# Altium schematic sheet Sheet1.SchDoc
size A4; SheetNumber: 1; SheetTotal: 1
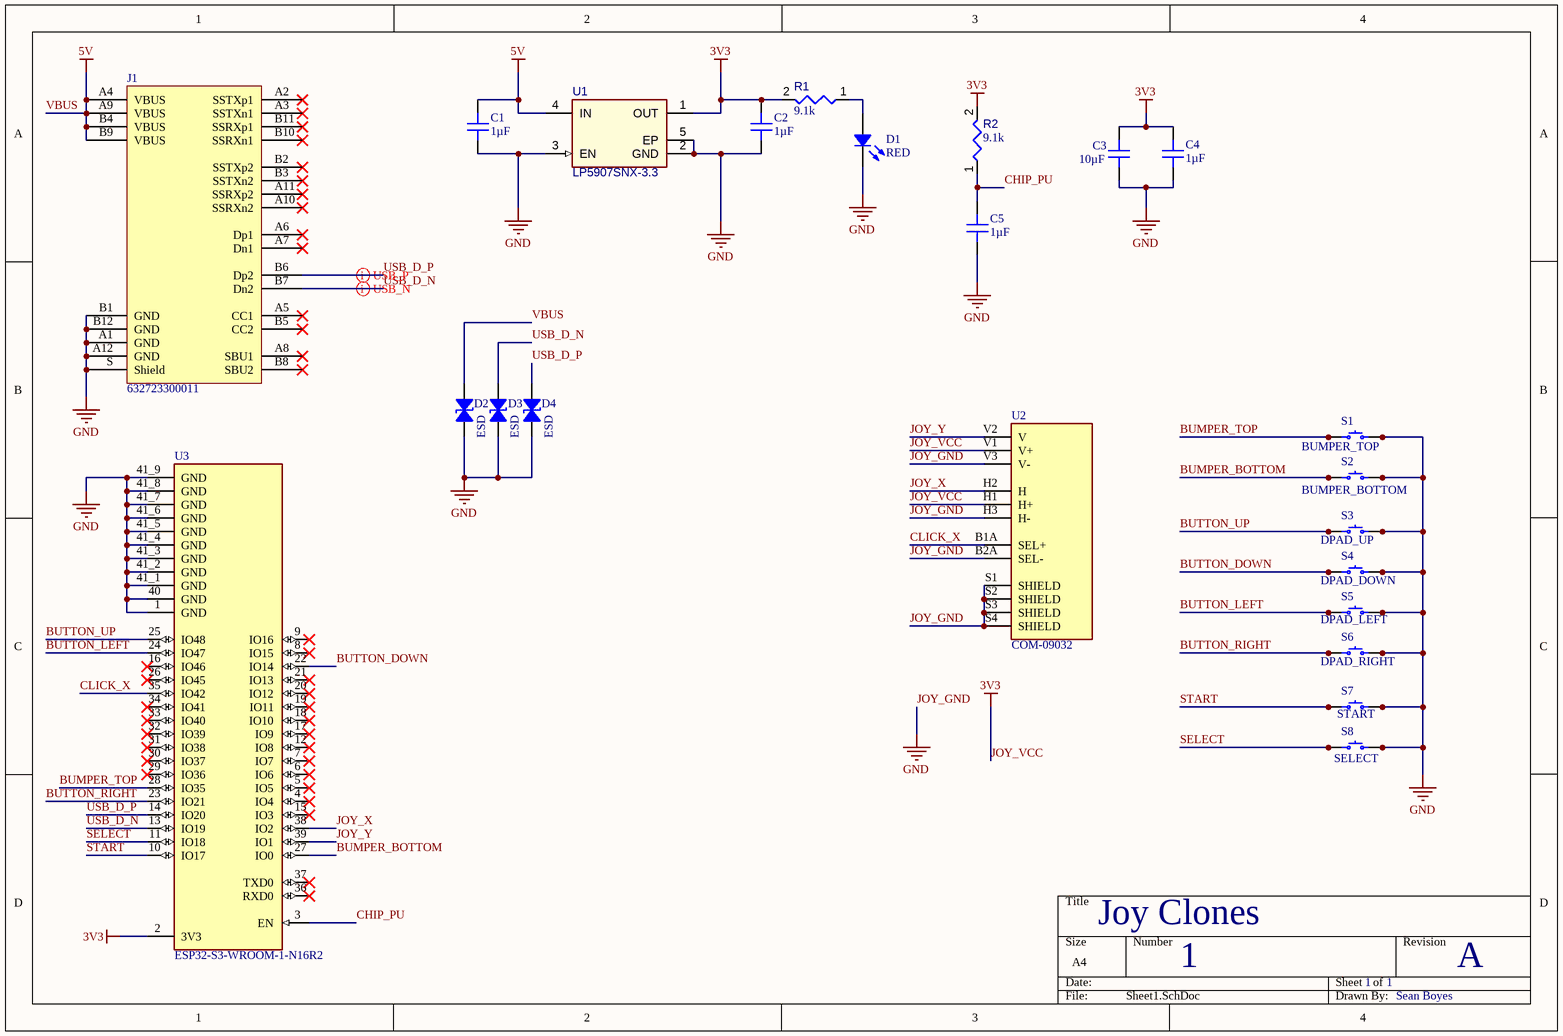
[diagram p0: Sheet1.SchDoc]

## Parts
C1  value 1µF  [CAP 0402_1005]  (hidden comment: CL05Y105KP6VPNC)
C2  value 1µF  [CAP 0402_1005]  (hidden comment: CL05Y105KP6VPNC)
C3  value 10µF  [CAP 0603_1608]  (hidden comment: GRM188C80J106MEA6J)
C4  value 1µF  [CAP 0402_1005]  (hidden comment: CL05Y105KP6VPNC)
C5  value 1µF  [CAP 0402_1005]  (hidden comment: CL05Y105KP6VPNC)
D1  RED  [LED 0603_1608 RED]
D2  ESD  [0402]
D3  ESD  [0402]
D4  ESD  [0402]
J1  632723300011  [WURTH 632723300011]
R1  value 9.1k  [RESC0402(1005)_L]  (hidden comment: 9D1KR2J)
R2  value 9.1k  [RESC0402(1005)_L]  (hidden comment: 9D1KR2J)
S1  BUMPER_TOP  [C&K PTS810]
S2  BUMPER_BOTTOM  [C&K PTS810]
S3  DPAD_UP  [C&K PTS810]
S4  DPAD_DOWN  [C&K PTS810]
S5  DPAD_LEFT  [C&K PTS810]
S6  DPAD_RIGHT  [C&K PTS810]
S7  START  [C&K PTS810]
S8  SELECT  [C&K PTS810]
U1  LP5907SNX-3.3  [TI-DQN4-480X480TP_V]
U2  COM-09032  [XDCR_COM-09032]
U3  ESP32-S3-WROOM-1-N16R2  [XCVR_ESP32-S3-WROOM-1-N16R2]

## Nets
JOY_GND: C1.1 C2.1 C3.1 C4.1 C5.1 D1.2 D2.2 D3.2 D4.2 J1.A1(GND) J1.A12(GND) J1.B1(GND) J1.B12(GND) J1.S(Shield) S1.3 S1.4 S2.3 S2.4 S3.3 S3.4 S4.3 S4.4 S5.3 S5.4 S6.3 S6.4 S7.3 S7.4 S8.3 S8.4 U1.2(GND) U1.3(EN) U1.5(EP) U2.B2A(SEL-) U2.H3(H-) U2.S1(SHIELD) U2.S2(SHIELD) U2.S3(SHIELD) U2.S4(SHIELD) U2.V3(V-) U3.1(GND) U3.40(GND) U3.41_1(GND) U3.41_2(GND) U3.41_3(GND) U3.41_4(GND) U3.41_5(GND) U3.41_6(GND) U3.41_7(GND) U3.41_8(GND) U3.41_9(GND)  [also labelled GND]
JOY_VCC: C2.2 C3.2 C4.2 R1.2 R2.2 U1.1(OUT) U2.H1(H+) U2.V1(V+) U3.2(3V3)  [also labelled 3V3]
VBUS: C1.2 D2.1 J1.A4(VBUS) J1.A9(VBUS) J1.B4(VBUS) J1.B9(VBUS) U1.4(IN)  [also labelled 5V]
BUMPER_BOTTOM: S2.1 S2.2 U3.27(IO0)
BUMPER_TOP: S1.1 S1.2 U3.28(IO35)
BUTTON_DOWN: S4.1 S4.2 U3.22(IO14)
BUTTON_LEFT: S5.1 S5.2 U3.24(IO47)
BUTTON_RIGHT: S6.1 S6.2 U3.23(IO21)
BUTTON_UP: S3.1 S3.2 U3.25(IO48)
CHIP_PU: C5.2 R2.1 U3.3(EN)
CLICK_X: U2.B1A(SEL+) U3.35(IO42)
JOY_X: U2.H2(H) U3.38(IO2)
JOY_Y: U2.V2(V) U3.39(IO1)
SELECT: S8.1 S8.2 U3.11(IO18)
START: S7.1 S7.2 U3.10(IO17)
USB_D_N: D3.1 J1.B7(Dn2) U3.13(IO19)
USB_D_P: D4.1 J1.B6(Dp2) U3.14(IO20)
NetD1_1: D1.1 R1.1

Not connected (* = marked no-connect by the designer): J1 A2(SSTXp1)* A3(SSTXn1)* A5(CC1)* A6(Dp1)* A7(Dn1)* A8(SBU1)* A10(SSRXn2)* A11(SSRXp2)* B2(SSTXp2)* B3(SSTXn2)* B5(CC2)* B8(SBU2)* B10(SSRXn1)* B11(SSRXp1)*; U3 4(IO4)* 5(IO5)* 6(IO6)* 7(IO7)* 8(IO15)* 9(IO16)* 12(IO8)* 15(IO3)* 16(IO46)* 17(IO9)* 18(IO10)* 19(IO11)* 20(IO12)* 21(IO13)* 26(IO45)* 29(IO36)* 30(IO37)* 31(IO38)* 32(IO39)* 33(IO40)* 34(IO41)* 36(RXD0)* 37(TXD0)*

## Layout directives
differential pair; differential pair class USB: USB_D_N, USB_D_P

## Notes on the sheet
- Joy Clones
- 1
- A
- Sean Boyes

## Library data of the parts
C1 C2 C4 C5 = CMP-001-29091-1: CAP CER 1UF 10V X7S 0402; manufacturer: Samsung Electro-Mechanics; Tolerance: 10%; Case/Package: 0402 (1005 Metric); Lifecycle Status: Active; Part Number: CL05Y105KP6VPNC; Minimum Order: 1; lastupdated: 2023-09-28 7:03:54 PM; Part Status: Active; price: 0.03; ComponentLink1Description: Datasheet; ComponentLink2Description: DigiKey Link; Mounting Type: Surface Mount, MLCC; Operating Temperature: -55°C ~ 125°C; packaging: CutTape; partid: 40006; Applications: Automotive; ComponentLink2URL: https://www.digikey.com/en/products/detail/samsung-electro-mechanics/CL05Y105KP6VPNC/11487815; ComponentLink1URL: http://www.samsungsem.com/kr/support/product-search/mlcc/__icsFiles/afieldfile/2018/06/26/CL05Y105KP6VPNC.pdf; Device Package: 0402 (1005 Metric); Temperature Coefficient: X7S; series: CL; Ratings: AEC-Q200
C3 = CMP-001-39906-1: CAP CER 10UF 6.3V X6S 0603; manufacturer: Murata Electronics; Tolerance: 20%; series: GRM; Mounting Type: Surface Mount, MLCC; Applications: General Purpose; ComponentLink1Description: DigiKey Link; Temperature Coefficient: X6S; price: 0.01; Voltage - Rated: 6.3V; Part Number: GRM188C80J106MEA6J; Device Package: 0603 (1608 Metric); packaging: TapeAndReel; Part Status: Active; Size / Dimension: 0.063" L x 0.032" W (1.60mm x 0.80mm); ComponentLink1URL: https://www.digikey.com/en/products/detail/murata-electronics/GRM188C80J106MEA6J/10704296; Operating Temperature: -55°C ~ 105°C; Case/Package: 0603 (1608 Metric); Thickness (Max): 0.037" (0.95mm); partid: 55208; lastupdated: 2023-09-28 7:07:22 PM; Minimum Order: 1; Lifecycle Status: Active
D1 = CMP-004-14433-1: LED RED CLEAR 2SMD; Manufacturer: Everlight Electronics Co Ltd; Part Number: EAST16084RA0; Viewing Angle: 120°; Voltage - Forward (Vf) (Typ): 2V; Wavelength - Dominant: 624nm; Millicandela Rating: 79mcd; Lens Size: 1.00mm x 0.80mm; Lens Color: Colorless; Lens Style: Rectangle with Flat Top; Configuration: Standard; Wavelength - Peak: 632nm; Current - Test: 20mA; Part Status: Active; Packaging: TapeAndReel; Size / Dimension: 1.60mm L x 0.80mm W; Supplier Device Package: 2-SMD; Series: -; Device Package: 0603 (1608 Metric); Lens Transparency: Clear; Price: 0.03; LastUpdated: 2023-09-28 8:20:24 PM; Color: Red; Lifecycle Status: Active; Value: Red; Case/Package: 0603 (1608 Metric); ComponentLink2URL: https://www.digikey.com/en/products/detail/everlight-electronics-co-ltd/EAST16084RA0/5142354; Height (Max): 0.50mm; ComponentLink1URL: https://everlightamericas.com/index.php?controller=attachment&id_attachment=918; ComponentLink1Description: Datasheet; Mounting Type: Surface Mount; Minimum Order: 1; ComponentLink2Description: DigiKey Link; PartId: 941
D2-D4 = CMP-004-08678-1: TVS DIODE 5V 8.2V 2X2DFN; Part Number: ESDM3051N2T5G; Manufacturer: ON Semiconductor; Power Line Protection: No; Voltage - Reverse Standoff (Typ): 5V (Max); Type: Zener; Voltage - Breakdown (Min): 5.1V; Capacitance @ Frequency: 21pF @ 1MHz (Max); Current - Peak Pulse (10/1000µs): 8A; Bidirectional Channels: 1; PartId: 10501; Price: 0.04; ComponentLink1Description: Datasheet; Minimum Order: 1; ComponentLink1URL: https://www.onsemi.com/pub/Collateral/ESDM3051-D.PDF; Operating Temperature: -55°C ~ 150°C (TJ); LastUpdated: 2023-09-28 8:41:31 PM; Device Package: 0402 (1006 Metric); ComponentLink2URL: http://digikey.com/product-detail/en/on-semiconductor/ESDM3051N2T5G/ESDM3051N2T5GOSCT-ND/8024483; Case/Package: 0402 (1006 Metric); Applications: USB; Mounting Type: Surface Mount; Part Status: Active; Lifecycle Status: Active; Supplier Device Package: 2-X2DFN (1x0.6); Series: -; ComponentLink2Description: DigiKey Link; Packaging: TapeAndReel; Voltage - Clamping (Max) @ Ipp: 8.2V
J1 = CMP-002-00380-1: CONN RCP USB3.1 TYPEC 24P SMD RA; Manufacturer: Würth Elektronik; Gender: Receptacle; Current Rating (Amps): 5A; Number of Contacts: 24; Shielding: Unshielded; Number of Ports: 1; Connector Type: USB - C (Type - C); Specifications: USB 3.1 (USB 3.1 Gen 2, Superspeed+); Voltage - Rated: 20VDC; Mating Cycles: 10000; Minimum Order: 1; Series: WR-COM; Lifecycle Status: Active; Operating Temperature: -40°C ~ 105°C; ComponentLink2Description: DigiKey Link; Packaging: TapeAndReel; LastUpdated: 2020-05-24 10:36:40 PM; Termination: Solder; Price: 2.95; Part Status: Active; Mounting Feature: Horizontal; Part Number: 632723300011; ComponentLink2URL: http://digikey.com/product-detail/en/w-rth-elektronik/632723300011/732-9618-1-ND/5806673; ComponentLink1URL: https://katalog.we-online.de/em/datasheet/632723x00011.pdf; ComponentLink1Description: Datasheet; Mounting Type: Surface Mount, Right Angle; Through Hole
R1 R2 = CMP-009-00114-3: 9K1 0.063W 5% 0402 (1005 Metric)  SMD; Power: 63mW; Pins: 2; Mounting Technology: SMT; Case/Package: 0402; Tolerance: 5%
S1-S8 = CMP-011-00060-1: SWITCH TACTILE SPST-NO 0.05A 16V; Part Number: PTS810 SJM 250 SMTR LFS; Manufacturer: C&K; Contact Rating @ Voltage: 0.05A @ 16VDC; Actuator Orientation: Top Actuated; Outline: 4.20mm x 3.20mm; Operating Force: 160gf; Illumination: Non-Illuminated; Actuator Type: Oval Button; Switch Function: Off-Mom; Actuator Height off PCB, Vertical: 2.50mm; ComponentLink2Description: DigiKey Link; ComponentLink2URL: http://digikey.com/product-detail/en/c-k/PTS810-SJM-250-SMTR-LFS/CKN10502CT-ND/4176673; Minimum Order: 1; Price: 0.16; Termination Style: J Lead; Mounting Type: Surface Mount; Circuit: SPST-NO; Packaging: TapeAndReel; ComponentLink1Description: Datasheet; Lifecycle Status: Active; ComponentLink1URL: https://dznh3ojzb2azq.cloudfront.net/products/Tactile/PTS810/documents/datasheet.pdf; Series: PTS810; Operating Temperature: -40°C ~ 85°C; LastUpdated: 2020-04-09 10:00:13 AM; Part Status: Active
U1 = CMP-019-00040-3: Ultra-Low-Noise, Low-IQ LDO, 3.3 V, 0.25 A, -40 to 125 degC, 4-Pin X2SON, RoHS, Tape and Reel; Output Voltage: 3.3V; Pins: 5; Max Operating Temperature: 125°C; Min Operating Temperature: -40°C
U2 = COM-09032: Thumb Joystick; Price: None; Availability: Unavailable; MP: COM-09032; Value: *; Package: None
U3 = CMP-319-000000-2: Bluetooth, WiFi 802.11b/g/n, Bluetooth v5.0 Transceiver Module 2.4GHz PCB Trace Surface Mount; MF: Espressif Systems; Value: *; Component Type: Standard; Design Item ID: ESP32-S3-WROOM-1-N16R2; SnapEDA_Link: https://www.snapeda.com/parts/ESP32-S3-WROOM-1-N16R2/Espressif+Systems/view-part/?ref=snap; Availability: In Stock; MP: ESP32-S3-WROOM-1-N16R2; Price: None; Pin Count: 49; Check_prices: https://www.snapeda.com/parts/ESP32-S3-WROOM-1-N16R2/Espressif+Systems/view-part/?ref=eda; Source: ESP32-S3-WROOM-1-N16R2.SchLib; Package: None; Purchase-URL: https://pricing.snapeda.com/search/part/ESP32-S3-WROOM-1-N16R2/?ref=eda